# Altium schematic sheet USBWandler.SchDoc
size A4; Author: FroH; CompanyName: n-tree solutions Ticketsysteme GmbH; Engineer: FroH; Address1: Brosswaldengasse 12; Address2: 6900 Bregenz; DocumentNumber: 400-0001-0026; Revision: b; SheetNumber: 1; SheetTotal: 1; DocumentName: USB Wandler
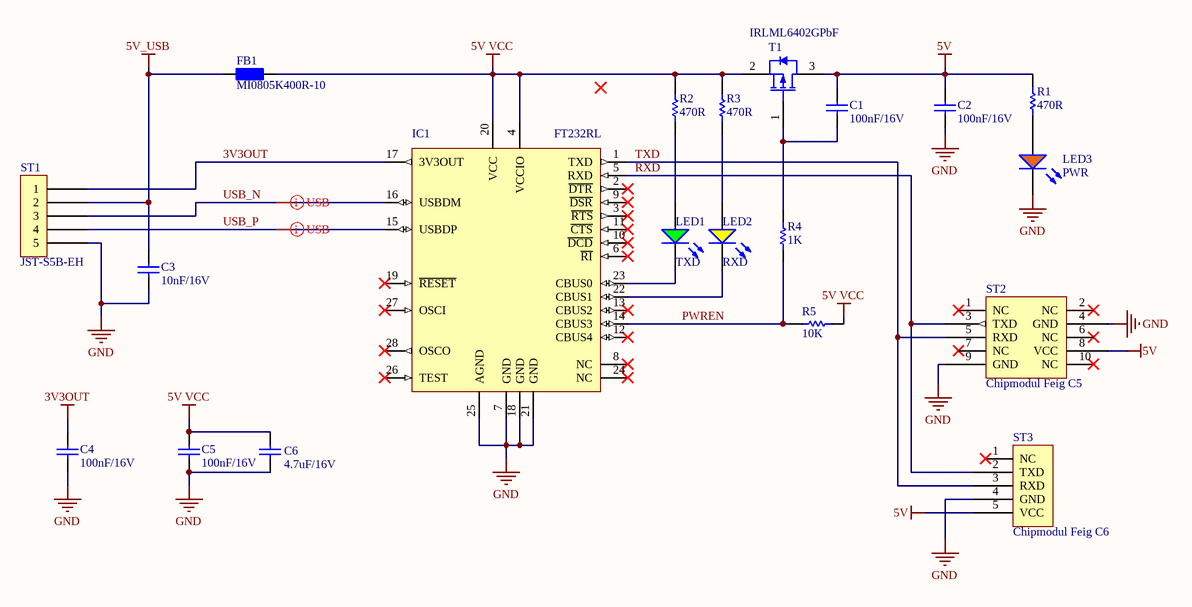
[diagram p0: USBWandler.SchDoc]

## Parts
C1  100nF/16V  [CAPC0805(2012)145_L]
C2  100nF/16V  [CAPC0805(2012)145_L]
C3  10nF/16V  [CAPC0805(2012)145_M]
C4  100nF/16V  [CAPC0805(2012)145_L]
C5  100nF/16V  [CAPC0805(2012)145_L]
C6  4.7uF/16V  [CAPC1206(3216)190_N]
FB1  MI0805K400R-10  [L0805 (2012)]
IC1  FT232RL  [SSOP-28_M]
LED1  TXD  [LTST-C170GKT_V]
LED2  RXD  [LTST-C170YKT_V]
LED3  PWR  [LTST-C171AKT_V]
R1  470R  [RESC0805(2012)_M]
R2  470R  [RESC0805(2012)_M]
R3  470R  [RESC0805(2012)_M]
R4  1K  [RESC0805(2012)_M]
R5  10K  [RESC0805(2012)_M]
ST1  JST-S5B-EH  [JST-S5B-EH]
ST2  Chipmodul Feig C5  [ChipModul Feig C5]
ST3  Chipmodul Feig C6  [ChipModul Feig C6]
T1  IRLML6402GPbF  [INTR-SOT-23-3_V]

## Nets
3V3OUT: C4.2 IC1.17(3V3OUT) ST1.1
5V: C1.2 C2.2 R1.2 ST2.8(VCC) ST3.5(VCC) T1.3(D)
5V VCC: C5.2 C6.2 FB1.2 IC1.4(VCCIO) IC1.20(VCC) R2.2 R3.2 R5.1 T1.2(S)
5V_USB: C3.2 FB1.1 ST1.2
GND: C2.1 C3.1 C4.1 C5.1 C6.1 IC1.7(GND) IC1.18(GND) IC1.21(GND) IC1.25(AGND) LED3.C ST1.5 ST2.4(GND) ST2.9(GND) ST3.4(GND)
PWREN: IC1.14(CBUS3) R4.1 R5.2
RXD: IC1.5(RXD) ST2.3(TXD) ST3.2(TXD)
TXD: IC1.1(TXD) ST2.5(RXD) ST3.3(RXD)
USB_N: IC1.16(USBDM) ST1.3
USB_P: IC1.15(USBDP) ST1.4
NetC1_1: C1.1 R4.2 T1.1(G)
NetIC1_22: IC1.22(CBUS1) LED2.C
NetIC1_23: IC1.23(CBUS0) LED1.C
NetLED1_A: LED1.A R2.1
NetLED2_A: LED2.A R3.1
NetLED3_A: LED3.A R1.1

Not connected (* = marked no-connect by the designer): IC1 2(~{DTR})* 3(~{RTS})* 6(~{RI})* 8(NC)* 9(~{DSR})* 10(~{DCD})* 11(~{CTS})* 12(CBUS4)* 13(CBUS2)* 19(~{RESET})* 24(NC)* 26(TEST)* 27(OSCI)* 28(OSCO)*; ST2 1(NC)* 2(NC)* 6(NC)* 7(NC)* 10(NC)*; ST3 1(NC)*

## Layout directives
differential pair: USB_N, USB_P

## Notes on the sheet
- Weitergabe sowie Vervielfältigung dieses Dokuments, Verwertung und Mitteilung seines Inhalts sind verboten, soweit nicht ausdrücklich gestattet.
  Zuwiderhandlungen verpflichten zu Schadenersatz. Alle Rechte für den Fall der Patent-, Gebrauchsmuster- oder Geschmacksmustereintragung vorbehalten.
  The reproduction, distribution and utilization of this document as well as the communication of its contents to others without express authorization is prohibited.
  Offenders will be held liable for the payment of damages. All rights reserved in the event of the grant of a patent, utility model or design.
- Size:
- Date:
- A4
- PartNo.:
- Time:
- Revision:
- Sheet
- of
- n-tree solutions GmbH
- Brosswaldengasse 12
- 6900 Bregenz
- Austria
- www.n-tree.com
- File:

## Library data of the parts
C1 C2 C4 C5 = CMP-1036-04401-1: CAP 100nF 16V ±10% 0805 (2012 Metric) Thickness 1.45mm SMD; Case-Metric: 2012; Case-EIA: 0805; Tolerance: Â±10%; Max Thickness: 1.45 mm; Technology: SMT; Value: 100nF; Rated Voltage: 16 V
C3 = CMP-1036-03813-1: CAP 10nF 16V ±1% 0805 (2012 Metric) Thickness 1.45mm SMD; Tolerance: Â±1%; Case-EIA: 0805; Case-Metric: 2012; Rated Voltage: 16 V; Max Thickness: 1.45 mm; Technology: SMT; Value: 10nF
C6 = CMP-1037-04912-1: CAP 4.7uF 16V ±20% 1206 (3216 Metric) Thickness 1.9mm SMD; Tolerance: Â±20%; Case-EIA: 1206; Case-Metric: 3216; Max Thickness: 1.9 mm; Technology: SMT; Rated Voltage: 16 V; Value: 4.7uF
FB1 = Ferrit Bead MI0805K400R-10: Ferrite Chip Beads MI0805K400R-10, 0805, 40 ohm, 1,5A; Manufakture: Laird Technologies; Impedanz: 40 Ohm; Max Current: 1.5A; Manufacture Partnumber: MI0805K400R-10
IC1 = CMP-0078-00029-3: USB UART Asynchronous Serial Data Transfer Chip, 28-pin SSOP, Tape and Reel; PartNumber: FT232RL-Reel; Manufacturer: FTDI; PackageVersion: Mar-12; PackageReference: SSOP-28; ComponentLink2Description: Datasheet; DatasheetVersion: ver 2.10, Mar-2012; PackageDescription: 28-Pin Small Outline Package 0.65 mm Pitch; ComponentLink1Description: Manufacturer URL; RevisionNote: DatasheetVersion updated to 2.10 Mar-2012; ComponentLink1URL: http://www.ftdichip.com/; ComponentLink2URL: http://www.ftdichip.com/Support/Documents/DataSheets/ICs/DS_FT232R.pdf
LED1 = CMP-1674-00002-2: LED GREEN CLEAR 0805 SMD; PartNumber: LTST-C170GKT; ComponentLink1Description: Datasheet; PackageReference: C170GKT; ComponentLink1URL: http://media.digikey.com/pdf/Data%20Sheets/Lite-On%20PDFs/LTST-C170GKT.pdf
LED2 = CMP-1674-00003-3: LED YELLOW CLEAR 0805 SMD; Manufacturer: Lite-On; PartNumber: LTST-C170YKT; ComponentLink1Description: Datasheet; ComponentLink1URL: http://media.digikey.com/pdf/Data Sheets/Lite-On PDFs/LTST-C170YKT.pdf; PackageReference: C170YKT
LED3 = CMP-1674-00004-3: LED AMBER CLR THIN 0805 SMD; PartNumber: LTST-C171AKT; Manufacturer: Lite-On; ComponentLink1URL: http://optoelectronics.liteon.com/upload/download/DS-22-99-0170/S_110_LTST-C171AKT.pdf; PackageReference: C171AKT; ComponentLink1Description: Datasheet
R1-R3 = CMP-1013-00473-1: 470R 0.125W 1% 0805 (2012 Metric)  SMD; Case-Metric: 2012; Value: 470.00 Ohm; Case-EIA: 0805; Power: 0.125 W; Technology: SMT; Tolerance: 1 %
R4 = CMP-1013-00510-1: 1K 0.125W 1% 0805 (2012 Metric)  SMD; Case-Metric: 2012; Value: 1000.00 Ohm; Case-EIA: 0805; Tolerance: 1 %; Power: 0.125 W; Technology: SMT
R5 = CMP-1013-00623-1: 10K 0.125W 1% 0805 (2012 Metric)  SMD; Value: 10000.00 Ohm; Case-Metric: 2012; Case-EIA: 0805; Tolerance: 1 %; Power: 0.125 W; Technology: SMT
ST1 = JST-S5B-EH: JST EH Connector RM=2,5mm, Side Entry Type; Number of Contacts: 5; RoHS: Compliant; Manufacturer Part Number: JST-S5B-EH; Contact Material: Phosphor Bronze; Mounting Style: Through Hole
ST2 = Chipmodul Feig C5: Feig Chipmodul CPR.02
T1 = CMP-0676-00001-1: HEXFET Power MOSFET, P-Channel, -20 V VDSS, 0.065 Ohm RDS, 3-Pin SOT23, RoHS, Tape and Reel; Manufacturer: International Rectifier; ISM (Max.): -22 A; QRR (Typ.): 11 nC; VSD (Max.): -1.2 V; IS (Max.): -1.3 A; VGS(TH): -0.4 to -1.2 V; V(BR)DSS (Min.): -20 V; TRR (Typ.): 29 ns; RDS (on): 0.065 Ohm; PartNumber: IRLML6402GPbF; Mounting Technology: Surface Mount; PackageReference: SOT-23-3; ComponentLink3URL: http://www.irf.com/product-info/datasheets/data/irlml6402gpbf.pdf; ComponentLink2URL: http://www.irf.com/product-info/datasheets/data/irlml6402gpbf.pdf; PackageDescription: 3-Pin SOT23, Body 2.92 x 1.3 mm, Pitch 1.9 mm; Packing: Tape and Reel; DatasheetVersion: 12/14/2011; ComponentLink1URL: http://www.irf.com/; ComponentLink3Description: Package Specification; ComponentLink2Description: Datasheet; RoHS: TRUE; ComponentLink1Description: Manufacturer URL